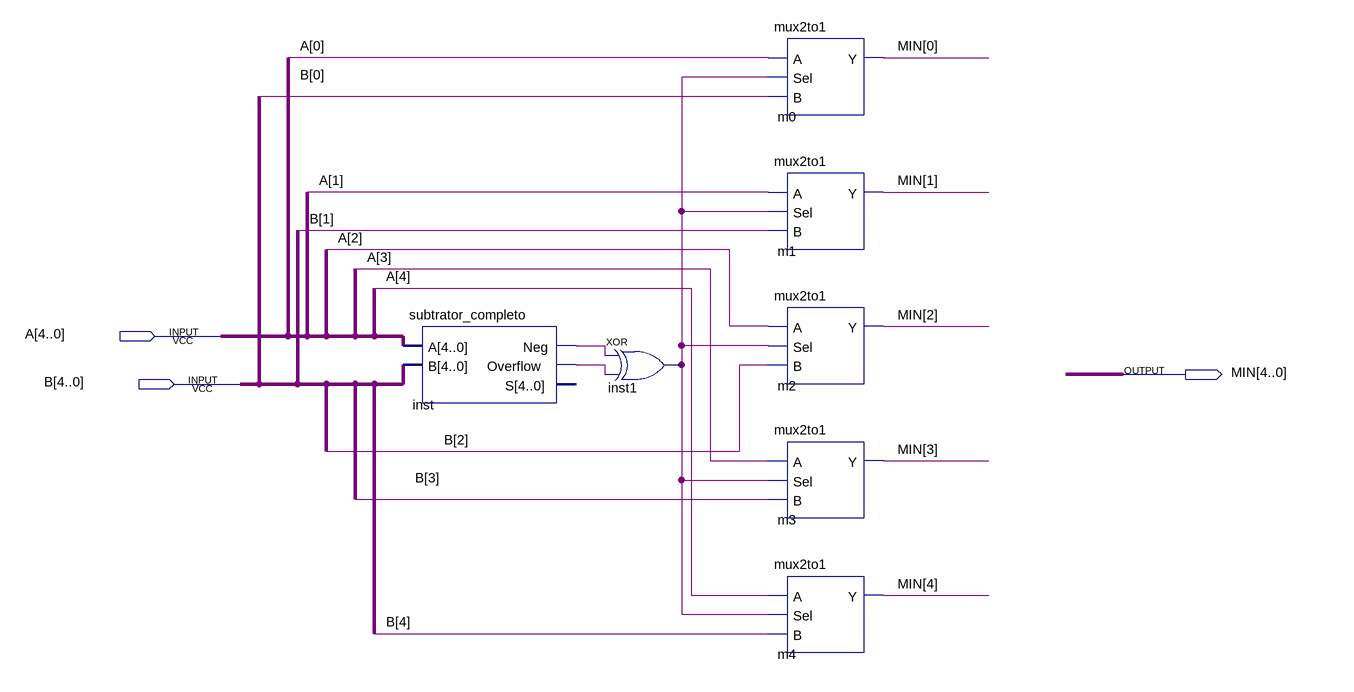
[diagram p0: schematic sheet]
// Quartus schematic min_ab.bdf as structural Verilog: 7 symbols, 3 pins
module min_ab (
  input  [4:0] A,
  input  [4:0] B,
  output [4:0] MIN
);

  wire inst1_out, inst_neg, inst_overflow;

  subtrator_completo inst (.A(A), .B(B), .Neg(inst_neg), .Overflow(inst_overflow));  // open: S
  xor inst1 (inst1_out, inst_neg, inst_overflow);
  mux2to1 m0 (.A(A[0]), .Sel(inst1_out), .B(B[0]), .Y(MIN[0]));
  mux2to1 m1 (.A(A[1]), .Sel(inst1_out), .B(B[1]), .Y(MIN[1]));
  mux2to1 m2 (.A(A[2]), .Sel(inst1_out), .B(B[2]), .Y(MIN[2]));
  mux2to1 m3 (.A(A[3]), .Sel(inst1_out), .B(B[3]), .Y(MIN[3]));
  mux2to1 m4 (.A(A[4]), .Sel(inst1_out), .B(B[4]), .Y(MIN[4]));
endmodule
